# EAGLE design NESv3 (EAGLE 5.11)
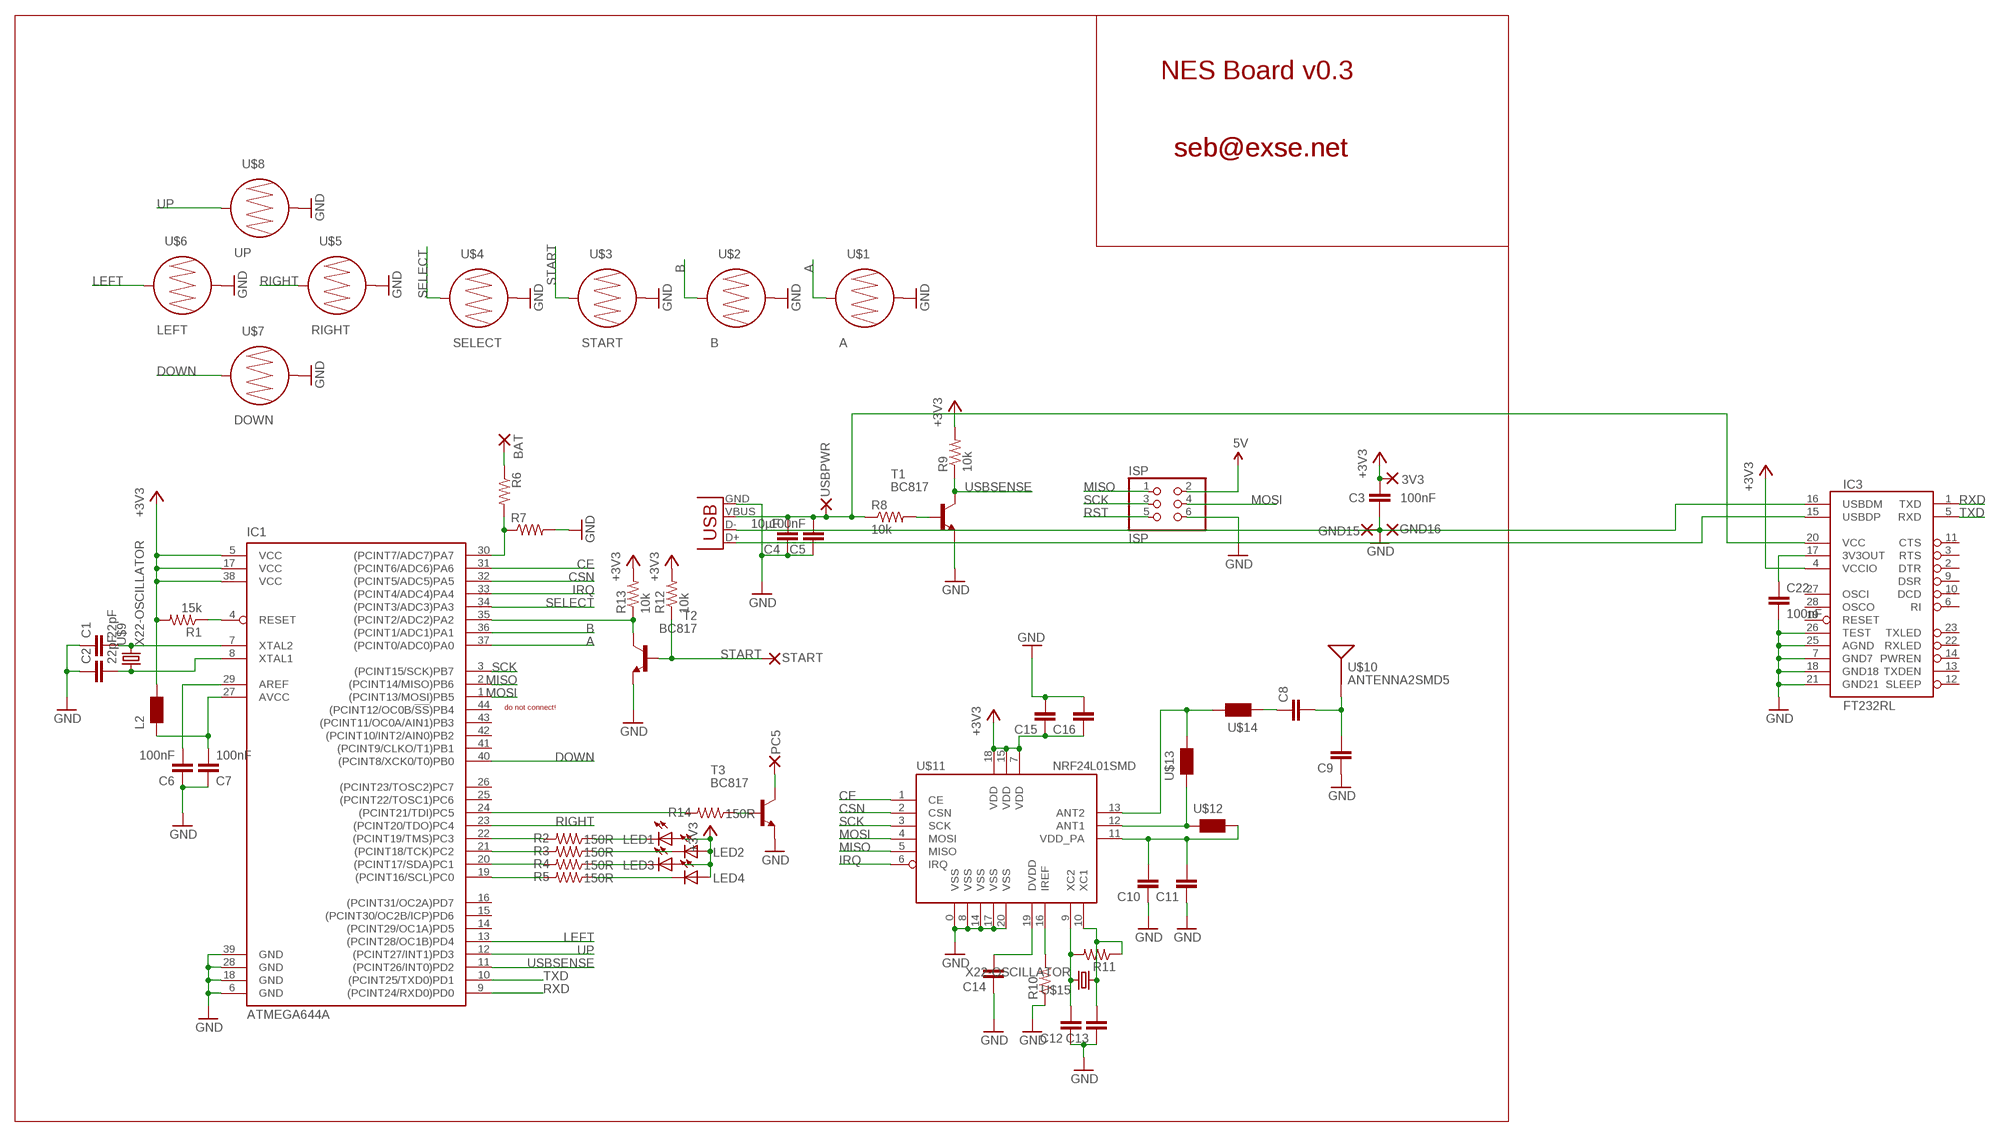
[diagram p0: schematic, sheet 1]

## Parts
3V3  SMD2  [SMD1,27-2,54]
BAT  SMD2  [SMD1,27-2,54]
C1  22pF  CAP0805  [0805]
C2  22pF  CAP0805  [0805]
C3  100nF  CAP0805  [0805]
C4  10µF  CAP0805  [0805]
C5  100nF  CAP0805  [0805]
C6  100nF  CAP0805  [0805]
C7  100nF  CAP0805  [0805]
C8  CAP0805  [0805]
C9  CAP0805  [0805]
C10  CAP0805  [0805]
C11  CAP0805  [0805]
C12  CAP0805  [0805]
C13  CAP0805  [0805]
C14  CAP0805  [0805]
C15  CAP0805  [0805]
C16  CAP0805  [0805]
C22  100nF  CAP0805  [0805]
GND15  SMD2  [SMD1,27-2,54]
GND16  SMD2  [SMD1,27-2,54]
IC1  ATMEGA644A  [TQFP44]
IC3  FT232RL  FT232RLSSOP  [SSOP28DB]
ISP  ISP  PINHD-2X03_2.54  [2X03]
L2  WE-KIHQ_0805  [WE-KI_0805_B]
LED1  LED3MM  [LED3MM]
LED2  LED3MM  [LED3MM]
LED3  LED3MM  [LED3MM]
LED4  LED3MM  [LED3MM]
PC5  SMD2  [SMD1,27-2,54]
R1  15k  RESISTOR  [0805]
R2  150R  RESISTOR  [0805]
R3  150R  RESISTOR  [0805]
R4  150R  RESISTOR  [0805]
R5  150R  RESISTOR  [0805]
R6  RESISTOR  [0805]
R7  RESISTOR  [0805]
R8  10k  RESISTOR  [0805]
R9  10k  RESISTOR  [0805]
R10  RESISTOR  [0805]
R11  RESISTOR  [0805]
R12  10k  RESISTOR  [0805]
R13  10k  RESISTOR  [0805]
R14  150R  RESISTOR  [0805]
START  SMD2  [SMD1,27-2,54]
T1  BC817  BC847  [SOT23]
T2  BC817  BC847  [SOT23]
T3  BC817  BC847  [SOT23]
U$1  A  BUTTON-CONDUCTIVESMD  [BUTTON-CONDUCTIVE]
U$2  B  BUTTON-CONDUCTIVESMD  [BUTTON-CONDUCTIVE]
U$3  START  BUTTON-CONDUCTIVESMD  [BUTTON-CONDUCTIVE]
U$4  SELECT  BUTTON-CONDUCTIVESMD  [BUTTON-CONDUCTIVE]
U$5  RIGHT  BUTTON-CONDUCTIVESMD  [BUTTON-CONDUCTIVE]
U$6  LEFT  BUTTON-CONDUCTIVESMD  [BUTTON-CONDUCTIVE]
U$7  DOWN  BUTTON-CONDUCTIVESMD  [BUTTON-CONDUCTIVE]
U$8  UP  BUTTON-CONDUCTIVESMD  [BUTTON-CONDUCTIVE]
U$9  X22-OSCILLATOR  [X22]
U$10  ANTENNA2SMD5  [ANTENNA-CHIP5]
U$11  NRF24L01SMD  [QFN20]
U$12  WE-KIHQ_0805  [WE-KI_0805_B]
U$13  WE-KIHQ_0805  [WE-KI_0805_B]
U$14  WE-KIHQ_0805  [WE-KI_0805_B]
U$15  X22-OSCILLATOR  [X22]
USBPWR  SMD2  [SMD1,27-2,54]
X1  USB-SMD-NS  [USB-MINIB-NOSTOP]

## Nets
5V: ISP.2
+3V3: 3V3.1(P) C3.1 C15.1 C16.1 IC1.5(VCC) IC1.17(VCC) IC1.38(VCC) IC3.4(VCCIO) L2.1 LED1.A LED2.A LED3.A LED4.A R1.2 R9.2 R12.2 R13.2 U$11.7(VDD) U$11.15(VDD) U$11.18(VDD)
+5V: C4.2 C5.2 IC3.20(VCC) R8.1 USBPWR.1(P) X1.VBUS
A: IC1.37((PCINT0/ADC0)PA0) U$1.1
B: IC1.36((PCINT1/ADC1)PA1) U$2.1
CE: IC1.31((PCINT6/ADC6)PA6) U$11.1(CE)
CSN: IC1.32((PCINT5/ADC5)PA5) U$11.2(CSN)
DOWN: IC1.40((PCINT8/XCK0/T0)PB0) U$7.1
GND: C1.1 C2.1 C3.2 C4.1 C5.1 C6.2 C7.2 C9.1 C10.1 C11.1 C12.1 C13.1 C14.1 C15.2 C16.2 C22.2 GND15.1(P) GND16.1(P) IC1.6(GND) IC1.18(GND) IC1.28(GND) IC1.39(GND) IC3.7(GND7) IC3.18(GND18) IC3.21(GND21) IC3.25(AGND) IC3.26(TEST) ISP.6 R7.2 R10.1 T1.2(E) T2.2(E) T3.2(E) U$1.2 U$2.2 U$3.2 U$4.2 U$5.2 U$6.2 U$7.2 U$8.2 U$11.0(VSS) U$11.8(VSS) U$11.14(VSS) U$11.17(VSS) U$11.20(VSS) X1.GND
IRQ: IC1.33((PCINT4/ADC4)PA4) U$11.6(IRQ)
LEFT: IC1.13((PCINT28/OC1B)PD4) U$6.1
MISO: IC1.2((PCINT14/MISO)PB6) ISP.1 U$11.5(MISO)
MOSI: IC1.1((PCINT13/MOSI)PB5) ISP.4 U$11.4(MOSI)
N$1: R14.1 T3.1(B)
N$2: C2.2 IC1.8(XTAL1) U$9.1
N$3: C1.2 IC1.7(XTAL2) U$9.3
N$4: IC1.19((PCINT16/SCL)PC0) R5.2
N$5: IC1.20((PCINT17/SDA)PC1) R4.2
N$6: IC1.21((PCINT18/TCK)PC2) R3.2
N$7: IC1.22((PCINT19/TMS)PC3) R2.2
N$8: LED1.K(C) R2.1
N$9: LED2.K(C) R3.1
N$10: LED3.K(C) R4.1
N$11: LED4.K(C) R5.1
N$12: R10.2 U$11.16(IREF)
N$13: C7.1 IC1.27(AVCC) L2.2
N$14: IC1.30((PCINT7/ADC7)PA7) R6.2 R7.1
N$16: BAT.1(P) R6.1
N$18: R8.2 T1.1(B)
N$20: C6.1 IC1.29(AREF)
N$21: IC1.35((PCINT2/ADC2)PA2) R13.1 T2.3(C)
N$22: IC1.24((PCINT21/TDI)PC5) R14.2
N$23: C13.2 R11.1 U$11.10(XC1) U$15.1
N$24: C12.2 R11.2 U$11.9(XC2) U$15.3
N$25: C10.2 C11.2 U$11.11(VDD_PA) U$12.1
N$26: U$11.12(ANT1) U$12.2 U$13.2
N$27: U$11.13(ANT2) U$13.1 U$14.1
N$28: C8.1 U$14.2
N$29: C8.2 C9.2 U$10.FEED(SIGNAL)
N$30: C14.2 U$11.19(DVDD)
N$31: IC3.16(USBDM) X1.D-
N$32: IC3.15(USBDP) X1.D+
N$35: C22.1 IC3.17(3V3OUT)
PC5: PC5.1(P) T3.3(C)
RIGHT: IC1.23((PCINT20/TDO)PC4) U$5.1
RST: IC1.4(RESET) ISP.5 R1.1
RXD: IC1.9((PCINT24/RXD0)PD0) IC3.1(TXD)
SCK: IC1.3((PCINT15/SCK)PB7) ISP.3 U$11.3(SCK)
SELECT: IC1.34((PCINT3/ADC3)PA3) U$4.1
START: R12.1 START.1(P) T2.1(B) U$3.1
TXD: IC1.10((PCINT25/TXD0)PD1) IC3.5(RXD)
UP: IC1.12((PCINT27/INT1)PD3) U$8.1
USBSENSE: IC1.11((PCINT26/INT0)PD2) R9.1 T1.3(C)
Unconnected: IC1.14((PCINT29/OC1A)PD5) IC1.15((PCINT30/OC2B/ICP)PD6) IC1.16((PCINT31/OC2A)PD7) IC1.25((PCINT22/TOSC1)PC6) IC1.26((PCINT23/TOSC2)PC7) IC1.41((PCINT9/CLKO/T1)PB1) IC1.42((PCINT10/INT2/AIN0)PB2) IC1.43((PCINT11/OC0A/AIN1)PB3) IC1.44((PCINT12/OC0B/!SS!)PB4) IC3.2(DTR) IC3.3(RTS) IC3.6(RI) IC3.9(DSR) IC3.10(DCD) IC3.11(CTS) IC3.12(SLEEP) IC3.13(TXDEN) IC3.14(PWREN) IC3.19(RESET) IC3.22(RXLED) IC3.23(TXLED) IC3.27(OSCI) IC3.28(OSCO)

## Notes on the sheet
- NES Board v0.3
- seb@exse.net | seb@exse.net
- do not connect!

## Library data of the parts
3V3 BAT GND15 GND16 PC5 START USBPWR = wirepad:SMD2: SMD PAD
C1-C16 C22 = SparkFun:CAP: Capacitor Standard 0603 ceramic capacitor, and 0.1" leaded capacitor.
IC1 = atmel:ATMEGA644: 8-bit Microcontroller with 64K Bytes In-System Programmable Flash Source: http://www.atmel.com/dyn/resources/prod_documents/doc2593.pdf; MPN: ATMEGA644PV-10AU; OC_FARNELL: 1455123; OC_NEWARK: 58M3748
IC3 = SparkFun:FT232RL: USB UART FT232RL 4th Generation USB UART (USB <-> Serial) Controller. Spark Fun Electronics SKU : COM-00650
ISP = pinhead-2:PINHD-2X03: PIN HEADER
L2 U$12-U$14 = wuerth-elektronik:WE-KIHQ: SMD Wire Wound Ceramic Inductor WE-KIHQ - High current - Highest Quality factor in size 0805 - up to 98 - High thermal stability - High SRF -- Bluetooth -- Wireless LAN -- RF oscillation circuit -- IF impedance matching -- IG choke
LED1-LED4 = SparkFun:LED: LEDs Standard schematic elements and footprints for 5mm, 3mm, 1206, and 0603 sized LEDs. 5mm - Spark Fun Electronics SKU : COM-00529 (and others)
R1-R14 = SparkFun:RESISTOR: Resistor Basic schematic elements and footprints for 0603, 1206, and PTH 1/10th watt (small) resistors.
T1-T3 = transistor:BC847: NPN TRANSISTOR
U$1-U$8 = SparkFun:BUTTON-CONDUCTIVE: Conductive Button Used with rubber key pads. This one was designed and proven to work with the PolyCase Key FOB enclosures.
U$9 U$15 = seb:X22-OSCILLATOR
U$10 = SparkFun:ANTENNA2: Antenna Single endded antenna. Common with smaller chip antennas. CHIP4 package is the GPS Chip Antenna SKU: GPS-08418. CHIP5 package is 2.4GHz chip antenna SKU: WRL-00144.
U$11 = SparkFun:NRF24L01: 2.4GHz Low Power Transceiver This is the very popular, low cost, very low power RF transceiver from Nordic Semiconductor. Simple SPI interface. SKU: COM-00690
X1 = SparkFun:USB: USB Connectors USB-B-PTH is fully proven SKU : PRT-00139 USB-miniB is fully proven SKU : PRT-00587 USB-A-PCB is untested. USB-A-H is throughly reviewed, but untested. Spark Fun Electronics SKU : PRT-00437 USB-B-SMT is throughly reviewed, but untested. Needs silkscreen touching up. USB-A-S has not been used/tested USB-MB-H has not been used/tested

## Board
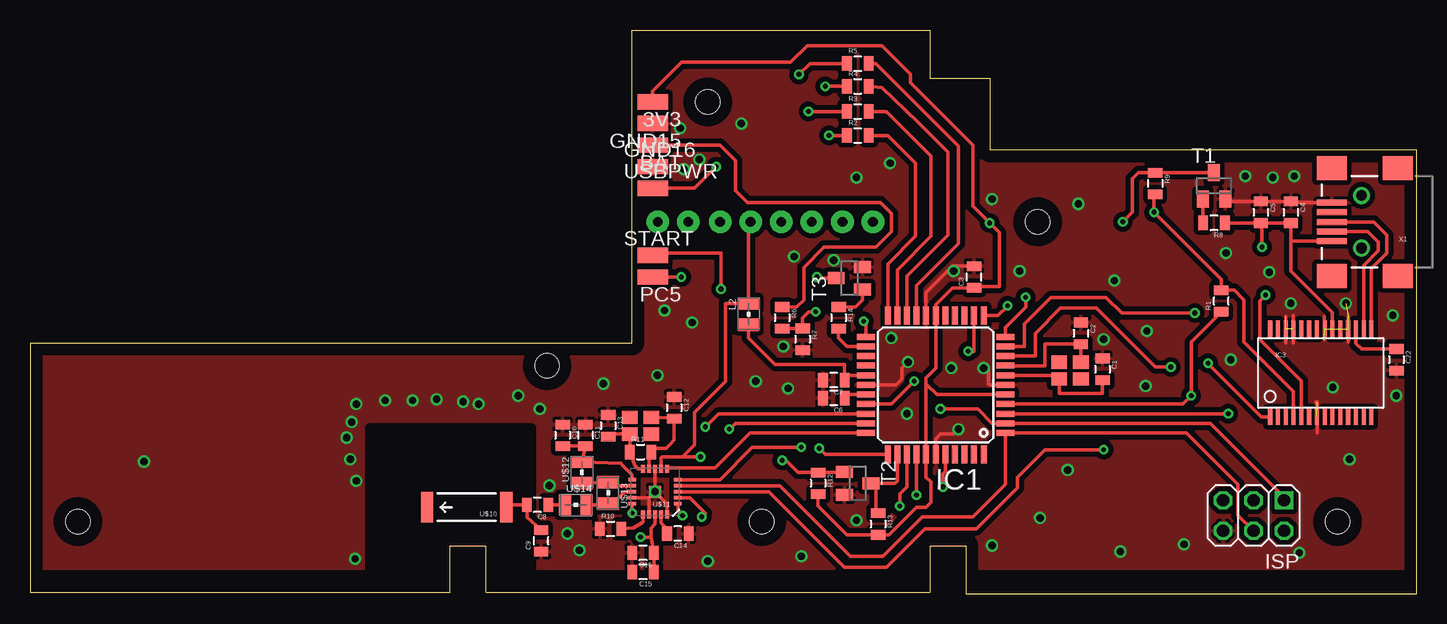
[diagram p1: board, top side]
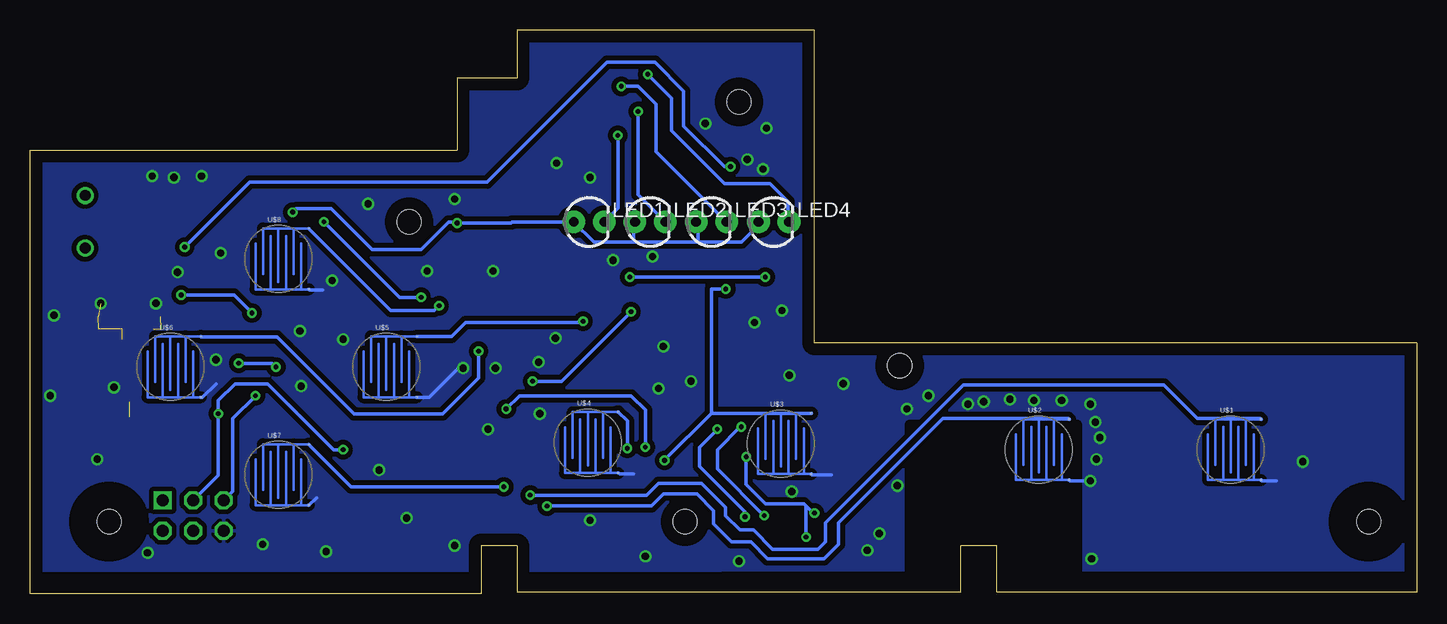
[diagram p2: board, bottom side, seen from below]

Size 115.6 x 47 mm. Coordinates in mm from the lower left corner, seen from the top.
Outline: 0,0.1 35,0.1 35,4 38,4 38,0.1 75,0.1 75,4 78,4 78,0 115.6,0 115.6,37 80,37 80,43 75,43 75,47 50.2,47 50.2,20.9 0,20.9 0,0.1
Copper layers (1*16): Top 0.035mm / dielectric 1.5mm / Bottom 0.035mm
Design rules "default *": minimum track width 10mil, minimum drill 0.3mm, track to track 8mil, track to pad 8mil, pad to pad 8mil, via to via 8mil, smd to smd 8mil, copper to edge 40mil, drill to drill 8mil, minimum pad ring 10mil, minimum via ring 8mil, stop-mask expansion 4mil, vias tented up to drill 0.6mm, thermal gap 10mil
Holes 2 mm at 4,6 61,6 109,6 56.5,41 84,31 43.1,19
tKeepout: area 91.3,15.9 to 97.3,21.9; area 19.6,11 to 25.6,17
bKeepout: area 59.6,4.6 to 62.4,7.4; area 55.1,39.6 to 57.9,42.4; area 41.7,17.7 to 44.5,20.5; area 82.4,29.5 to 85.2,32.3
tRestrict: area 28.3,0.4 to 41.8,13.8; 4 lines
bRestrict: area 28.3,0.2 to 42.3,14.1; area 107.6,4.6 to 110.4,7.4; area 2.6,4.6 to 5.4,7.4

### Footprints (pad centres in the part's own frame; a part is rotated, then mirrored left to right if it is on the bottom)
SMD1,27-2,54 = smd 1.27 x 2.54: 1 0,0
0805 = smd 0.8 x 1.2: 1 -0.9,0; 2 0.9,0
TQFP44 = smd 1.5 x 0.5: 1 -5.8,4; 2 -5.8,3.2; 3 -5.8,2.4; 4 -5.8,1.6; 5 -5.8,0.8; 6 -5.8,0; 7 -5.8,-0.8; 8 -5.8,-1.6; 9 -5.8,-2.4; 10 -5.8,-3.2; 11 -5.8,-4; 23 5.8,-4; 24 5.8,-3.2; 25 5.8,-2.4; 26 5.8,-1.6; 27 5.8,-0.8; 28 5.8,0; 29 5.8,0.8; 30 5.8,1.6; 31 5.8,2.4; 32 5.8,3.2; 33 5.8,4 | smd 0.5 x 1.5: 12 -4,-5.8; 13 -3.2,-5.8; 14 -2.4,-5.8; 15 -1.6,-5.8; 16 -0.8,-5.8; 17 0,-5.8; 18 0.8,-5.8; 19 1.6,-5.8; 20 2.4,-5.8; 21 3.2,-5.8; 22 4,-5.8; 34 4,5.8; 35 3.2,5.8; 36 2.4,5.8; 37 1.6,5.8; 38 0.8,5.8; 39 0,5.8; 40 -0.8,5.8; 41 -1.6,5.8; 42 -2.4,5.8; 43 -3.2,5.8; 44 -4,5.8
SSOP28DB = smd 0.348 x 1.397: 1 -4.225,-3.656; 2 -3.575,-3.656; 3 -2.925,-3.656; 4 -2.275,-3.656; 5 -1.625,-3.656; 6 -0.975,-3.656; 7 -0.325,-3.656; 8 0.325,-3.656; 9 0.975,-3.656; 10 1.625,-3.656; 11 2.275,-3.656; 12 2.925,-3.656; 13 3.575,-3.656; 14 4.225,-3.656; 15 4.225,3.656; 16 3.575,3.656; 17 2.925,3.656; 18 2.275,3.656; 19 1.625,3.656; 20 0.975,3.656; 21 0.325,3.656; 22 -0.325,3.656; 23 -0.975,3.656; 24 -1.625,3.656; 25 -2.275,3.656; 26 -2.925,3.656; 27 -3.575,3.656; 28 -4.225,3.656
2X03 = drill 1.016 square: 1 -2.54,-1.27 | drill 1.016 octagon: 2 -2.54,1.27; 3 0,-1.27; 4 0,1.27; 5 2.54,-1.27; 6 2.54,1.27
WE-KI_0805_B = smd 1.02 x 1.78: 1 -0.89,0; 2 0.89,0
LED3MM = drill 0.813 pad 1.88 round: A -1.27,0; K 1.27,0
SOT23 = smd 1 x 1.4: 1 -0.95,-1.1; 2 0.95,-1.1; 3 0,1.1
BUTTON-CONDUCTIVE = smd 0.203 x 0.203: 1 2.54,2.54; 2 2.54,-2.54
X22 = smd 1.3 x 1.1: 1 0.9,0.7; 2 -0.9,0.7; 3 -0.9,-0.7; 4 0.9,-0.7
ANTENNA-CHIP5 = smd 1.016 x 2.54: FEED -3.302,0; NC 3.302,0
QFN20 = smd 1 x 1: 0 0,0 | smd 0.65 x 0.3: 1 -1.9,1; 2 -1.9,0.5; 3 -1.9,0; 4 -1.9,-0.5; 5 -1.9,-1; 11 1.9,-1; 12 1.9,-0.5; 13 1.9,0; 14 1.9,0.5; 15 1.9,1 | smd 0.3 x 0.65: 6 -1,-1.9; 7 -0.5,-1.9; 8 0,-1.9; 9 0.5,-1.9; 10 1,-1.9; 16 1,1.9; 17 0.5,1.9; 18 0,1.9; 19 -0.5,1.9; 20 -1,1.9
USB-MINIB-NOSTOP = smd 2.5 x 0.5: D+ 2.5,0; D- 2.5,0.8; GND 2.5,-1.6; ID 2.5,-0.8; VBUS 2.5,1.6 | smd 2.5 x 2: G1 -3,-4.5; G2 -3,4.5; G3 2.5,4.5; G4 2.5,-4.5 | drill 0.9 pad 0.8 round: H1 0,2.2 | drill 0.9 pad 0.787 round: H2 0,-2.2

### Placement (x,y rotation side)
3V3  51.9,41 90 top
BAT  51.9,37.4 90 top
C1  89.4,18.7 270 top
C2  87.6,21.7 270 top
C3  78.7,26.4 90 top
C4  105.1,31.8 270 top
C5  102.6,31.8 270 top
C6  67,16.3 180 top
C7  67,17.8 180 top
C8  42.3,7.4 180 top
C9  42.6,4.4 90 top
C10  44.4,13.2 270 top
C11  46.3,13.2 270 top
C12  53.7,15.5 270 top
C13  48.2,14 270 top
C14  54,5 180 top
C15  51.1,1.8 180 top
C16  51.1,3.4 180 top
C22  113.9,19.5 270 top
GND15  51.9,39.2 90 top
GND16  51.9,35.6 270 top
IC1  75.5,17.4 180 top
IC3  107.6,18.4 0 top
ISP  102,6.5 180 top
L2  59.9,23.3 270 top
LED1  69,31 0 bottom
LED2  63.9,31 0 bottom
LED3  58.8,31 0 bottom
LED4  53.6,31 0 bottom
PC5  51.9,26.4 90 top
R1  99.3,24.4 90 top
R2  69,38.2 0 top
R3  69,40.2 0 top
R4  69,42.3 0 top
R5  69,44.2 0 top
R6  62.7,23 270 top
R7  64.4,21.2 270 top
R8  98.7,30.9 180 top
R9  93.8,34.2 270 top
R10  48.4,5.4 0 top
R11  50.9,11.8 0 top
R12  65.7,9.2 270 top
R13  70.7,5.8 270 top
R14  67.4,23 270 top
START  51.9,28.2 270 top
T1  98.7,34 0 top
T2  69,9.2 270 top
T3  68.3,26.3 90 top
U$1  15.5,12 0 bottom
U$2  31.5,12 0 bottom
U$3  53,12.5 0 bottom
U$4  69.1,12.6 0 bottom
U$5  85.9,18.9 0 bottom
U$6  103.9,18.9 0 bottom
U$7  94.9,9.9 0 bottom
U$8  94.9,27.9 0 bottom
U$9  86.7,18.6 0 top
U$10  36.4,7.2 180 top
U$11  52.1,8.5 180 top
U$12  46,10.1 270 top
U$13  48.2,8.4 90 top
U$14  45.5,7.4 180 top
U$15  50.9,14 180 top
USBPWR  51.9,33.8 270 top
X1  111,31 180 top

### Tracks (layer width: path | path; a pad name or v marks a point on that pad's centre or on a via)
+3V3  (via drill 0.4)
  Top 0.305: U$11.18 52.1,5.8 51.75,5.45 51.75,4.7 | 51.75,4.7 C16.1 C15.1 | v50.2,6.7 U$11.15 | U$11.7 52.6,11.3 52.7,11.4 54.4,11.4 | 51.75,4.7 v50.9,4.7 | v55.9,11.4 54.4,11.4 | 54.4,11.4 55.4,12.4 55.4,15.1 57.99,17.69 57.99,24.19 L2.1 59.9,30.83 LED3.A | 74.7,17.5 IC1.38 74.7,9.7 75.1,9.3 75.1,7.6 74.7,7.2 73.9,7.2 71.6,4.9 R13.2 | 74.7,17.5 74.7,18 75.5,18.8 IC1.17 75.5,24.1 76.9,25.5 C3.1 78.8,25.6 80.8,25.6 80.8,30.1 v80,30.9 78.6,32.3 78.6,37.4 73.4,42.6 73.4,43.3 71,45.7 64.8,45.7 63.4,44.3 54.3,44.3 51.9,41.9 3V3.1 | IC1.5 75.6,16.6 74.7,17.5 | R9.2 93.7,33.2 v93.7,31.8 99.3,26.2 R1.2 100.4,25.3 101.2,24.5 101.2,21 105.33,16.88 IC3.4 | R12.2 65.7,7.3 68.1,4.9 R13.2 | R13.2 70.5,4.9
  Bottom 0.305: 65.3,29.3 68.57,29.3 LED1.A 75.4,31 75.5,30.9 v80,30.9 80,31 80.7,31 83,28.7 87.1,28.7 90.5,32.1 93.4,32.1 v93.7,31.8 | 59.9,29.3 65.3,29.3 | 59.9,29.3 56.3,29.3 54.87,30.73 LED4.A | LED3.A 59.9,30.83 59.9,29.3 | LED2.A 65.3,30.87 65.3,29.3 | v55.9,11.4 55.9,9.1 54.3,7.5 51.1,7.5 50.9,7.3 | 50.9,7.3 50.3,6.7 v50.2,6.7 | v50.9,4.7 50.9,7.3
+5V  (via drill 0.4)
  Top 0.305: C5.2 C4.2 105.1,29.4 | C5.2 R8.1 | 105.1,29.4 X1.VBUS | v102.7,28.9 102.7,30.8 C5.2 | USBPWR.1 55.4,33.8 v57.2,35.6 | IC3.20 108.58,23.43 105.1,26.9 105.1,29.4
  Bottom 0.305: v102.7,28.9 97.3,34.3 77.5,34.3 67.5,44.3 63.5,44.3 61.1,41.9 61.1,39 57.7,35.6 v57.2,35.6
A  (via drill 0.4)
  Top 0.305: v73.9,8.2 IC1.37
  Bottom 0.305: U$1.1 13.02,14.6 18.3,14.6 21.1,17.4 37.8,17.4 49.3,5.9 49.3,4.3 49.9,3.7 53.7,3.7 55.3,5.3 56.4,5.3 57.6,6.5 57.6,7.2 59.6,9.2 63.2,9.2 64.2,8.2 v73.9,8.2
B  (via drill 0.4)
  Top 0.305: IC1.36 73.1,8.9 72.5,8.3 v72.5,7.3
  Bottom 0.305: U$2.1 29.02,14.6 34.8,14.6 | 34.8,14.6 35,14.6 | v72.5,7.3 72.2,7.3 63.8,7.3 62.8,8.3 60,8.3 58.6,6.9 58.6,5.8 57.1,4.3 56.5,4.3 55.5,4.3 54.1,2.9 49.4,2.9 48.2,4.1 48.2,5.9 39.7,14.4 39.5,14.6 34.8,14.6
CE  (via drill 0.4)
  Top 0.305: v54.4,6.5 54,6.9 U$11.1 | IC1.31 57.4,15 v56.3,13.9
  Bottom 0.305: v56.3,13.9 56.4,13.9 58.3,12 58.3,10.4 v54.4,6.5
CSN  (via drill 0.4)
  Top 0.305: IC1.32 64,14.2 59.6,14.2 58.8,14.2 v58.3,13.7 | 55,8 55.2,7.8 | U$11.2 55,8 | 55,8 56.3,6.7 v56,6.4
  Bottom 0.305: v56,6.4 56,6.8 59.8,10.6 59.8,12.2 v58.3,13.7
DOWN  (via drill 0.4)
  Top 0.305: v76.1,8.9 76.1,10 76.3,10.2 IC1.40
  Bottom 0.305: U$7.1 92.32,12.4 88.82,8.9 v76.1,8.9
GND  (via drill 0.6)  (7 unrouted)
  Top 0.305: X1.GND 105.1,32.6 C4.1 C5.1 99.65,32.7 T1.2 | 69.6,17.4 IC1.28 72.2,17.4 72.7,17.9 72.7,18.8 v73.2,19.3 | 51.6,8 U$11.17 | U$11.14 51.6,8 | 51.6,8 U$11.0 | U$11.0 U$11.8 | U$11.20 53.1,7.5 U$11.0 | IC1.18 74.7,25.1 76.9,27.3 C3.2 | IC1.6 80,17.4 79.9,17.5 79.9,18.8 | IC1.39 75.5,12.9 75.9,13.3 77,13.3 v77.4,13.7 | 104.7,20.9 104.7,23.1 | 105.3,20.9 105.3,23.2 | 107.9,21.2 107.9,23.1 | 109.9,21 109.9,23.1 | 107.2,16 107.3,16 107.3,13.4
  Bottom 0.305: U$7.2 91.72,8 91.7,8 | U$8.2 92.3,25.3 91.2,25.3 | U$4.2 66.42,10 65.3,10 | U$3.2 50.4,9.9 48.8,9.9 | U$2.2 28.9,9.4 27.7,9.4 | U$1.2 12.9,9.4 11.7,9.4 | U$5.2 82.34,16.36 79.5,19.2 | U$6.2 101.24,16.36 100.1,17.5
  other vias: 26.7,11.2 36.1,16 26.8,14.3 43.3,9 96.2,4.1 103.6,34.7 76.8,18.8 86.5,10.3 71.8,21.3 89.5,21.2 54.5,35.4 101.3,34.8 105.4,34.8 113.9,16.5 113.6,23.2 108.6,17.2 77,26.9 90.9,3.5 68.9,6.1 73.1,15 82.5,26.9 31.9,16.1 37.4,15.8 26.4,13 63.7,28.1 47.8,17.5 27.2,9.4 9.5,11 80.2,4 105.8,3.4 99.7,28.4 103.3,26.8 93.1,21.9 59.3,39.2 52.1,8.5 56.5,2.7 55.2,22.6 84.2,6.3 93,17.3 45.8,3.6 87.4,32.5 110,11.2 52.9,23.6 90.4,26.1 27.2,15.8 27.1,2.9 33.9,16.2 67,27.8 29.6,16.1 52.3,18.2 60.5,17.7 63.2,17.1 40.7,16.5 44.8,5 42.5,15.4 105.1,24.2 54.2,38.8 55.8,36.2 71.7,35.9 62.8,20.6 80.2,32.9 68.9,34.7 79.5,18.8 100.1,19.5 64.3,3.1 109.7,24.2
  pour Top (isolate 0.4): 115.9,2.1 115.8,47.1 -0.1,47.1 0,2.1
  pour Bottom (isolate 0.4): 115.9,1.9 115.6,47.2 -0.3,47.3 0,2
IRQ
  Top 0.305: U$11.6 53.2,10.5 57.1,10.5 60,13.4 IC1.33
LEFT  (via drill 0.4)
  Top 0.305: IC1.13 78.7,20.2 v78.2,20.2
  Bottom 0.305: v78.2,20.2 78.2,18 81.2,15 88.6,15 95,21.4 101.32,21.4 U$6.1
MISO  (via drill 0.4)
  Top 0.305: v75.9,15.4 79,15.4 80.2,14.2 IC1.2 98.4,14.2 104.54,8.06 ISP.1 | U$11.5 57.5,9.5 60.2,12.2 v64.3,12.2
  Bottom 0.305: v64.3,12.2 64.3,15.3 65.5,16.5 74.8,16.5 v75.9,15.4
MOSI
  Top 0.305: U$11.4 62.5,9 68.4,3.1 71.1,3.1 74.4,6.4 78.6,6.4 81.3,9.1 IC1.1 96.4,13.4 100.7,9.1 100.7,6.53 ISP.4
N$1
  Top 0.305: R14.1 68.8,23.9 69.4,24.5 T3.1
N$2
  Top 0.305: IC1.8 84.6,19 84.6,20.8 C2.2 U$9.1
N$3
  Top 0.305: IC1.7 85.6,18.2 U$9.3 85.8,16.7 89.4,16.7 C1.2
N$4
  Top 0.305: R5.2 70.5,44.2 74,40.7 77.4,37.3 77.4,29.2 73.9,25.7 IC1.19
N$5
  Top 0.305: R4.2 71,42.2 74,39.3 76.5,36.8 76.5,29.9 73.1,26.5 IC1.20
N$6
  Top 0.305: IC1.21 72.3,27 75.1,29.8 75.1,36.5 71.7,39.9 71.4,40.2 R3.2
N$7
  Top 0.305: IC1.22 71.5,27.5 73.8,29.8 73.8,35.9 72.1,37.6 71.5,38.2 R2.2
N$8  (via drill 0.4)
  Top 0.305: v66.6,38.2 R2.1
  Bottom 0.305: LED1.K 66.6,32.13 v66.6,38.2
N$9  (via drill 0.4)
  Top 0.305: v64.9,40.2 R3.1
  Bottom 0.305: LED2.K 64.9,33.27 v64.9,40.2
N$10  (via drill 0.4)
  Top 0.305: v66.3,42.3 R4.1
  Bottom 0.305: LED3.K 63.4,36.87 63.4,40.8 64.9,42.3 v66.3,42.3
N$11  (via drill 0.4)
  Top 0.305: R5.1 65,44.2 v64.1,43.3
  Bottom 0.305: LED4.K 52.4,31.07 52.4,32.7 53.9,34.2 57.7,34.2 62.1,38.6 62.1,41.3 64,43.2 v64.1,43.3
N$12
  Top 0.305: R10.2 50.3,5.5 51,5.9 51.1,6 U$11.16
N$13
  Top 0.305: C7.1 68.2,18.2 IC1.27 67.9,18.2 67.9,17.7 67.9,19.1 64.7,19.1 62.1,19.1 60.3,20.9 59.9,21.3 L2.2
N$14  (via drill 0.4)
  Top 0.305: R6.2 R7.1 64.4,23 64.9,23.5 v65.5,23.5 | IC1.30 71.8,15.8 v73.7,17.7
  Bottom 0.305: v73.7,17.7 71.3,17.7 v65.5,23.5
N$16
  Top 0.305: BAT.1 57.5,37.4 58.8,36.1 58.8,33.6 59.8,32.6 70.9,32.6 71.8,31.7 71.8,30.2 70.5,28.9 66.2,28.9 64.5,27.2 64.5,24.5 63.9,23.9 R6.1
N$18
  Top 0.305: R8.2 97.75,30.5 T1.1
N$20
  Top 0.305: IC1.29 68.2,16.6 C6.1
N$21
  Top 0.305: IC1.35 72.3,9.4 72.1,9.2 T2.3 70.5,9.3 70.5,6.7 R13.1
N$22
  Top 0.305: IC1.24 68.1,20.6 67.4,21.3 R14.2
N$23
  Top 0.305: C13.2 48.25,13.3 U$15.1 50,12.25 R11.1 50.45,10.65 50.5,10.6 50.7,10.4 U$11.10
N$24
  Top 0.305: U$15.3 51.85,14.75 C12.2 53.7,12.8 53.4,12.5 53,12.1 52.05,12.1 R11.2 51.6,11.65 U$11.9
N$25
  Top 0.305: U$11.11 50.2,9.9 49.4,10.7 49.25,10.85 U$12.1 C11.2 C10.2
N$26
  Top 0.305: U$11.12 48.45,9 U$13.2 U$12.2
N$27
  Top 0.305: U$14.1 48.3,7.4 U$13.1 48.55,7.45 49.2,8.1 49.6,8.5 U$11.13
N$28
  Top 0.305: C8.1 U$14.2
N$29
  Top 0.305: U$10.FEED 39.8,7.4 C8.2 41.45,6.35 C9.2
N$30
  Top 0.305: U$11.19 52.6,5.9 52.8,5.7 52.95,5.55 C14.2
N$31
  Top 0.305: X1.D- 111.5,30.2 112.4,29.3 112.4,28.6 111.17,27.38 IC3.16
N$32
  Top 0.305: IC3.15 111.83,27.12 113.1,28.4 113.1,29.9 112,31 X1.D+
N$35
  Top 0.305: IC3.17 110.53,20.88 111,20.4 C22.1
PC5  (via drill 0.4)
  Top 0.305: T3.3 65.7,26.3 v65.6,26.4 | PC5.1 v54.3,26.4
  Bottom 0.305: v54.3,26.4 v65.6,26.4
RIGHT  (via drill 0.4)
  Top 0.305: v69.5,22.7 69.7,22.5 IC1.23
  Bottom 0.305: U$5.1 80.46,21.44 79.3,22.6 69.6,22.6 v69.5,22.7
RST  (via drill 0.4)
  Top 0.305: IC1.4 96.1,15.8 v96.8,16.5 | v96.8,16.5 96.8,17.9 | R1.1 96.8,21 v96.8,16.5
  Bottom 0.305: ISP.5 98.7,8.53 98.7,14.6 v96.8,16.5
RXD  (via drill 0.4)
  Top 0.305: IC1.9 83.8,19.8 83.8,21.7 85.9,23.8 88.9,23.8 93.8,18.9 v95.1,18.9 | v98.2,19.2 102.66,14.74 IC3.1
  Bottom 0.305: v95.1,18.9 95.4,19.2 v98.2,19.2
SCK  (via drill 0.4)
  Top 0.305: v99.9,15 IC1.3 | v89.5,12 84.6,12 82.3,9.7 82.3,8.8 78.9,5.4 74.6,5.4 71.4,2.2 67.9,2.2 61.6,8.5 U$11.3
  Bottom 0.305: v89.5,12 90.3,12 95.8,17.5 98.5,17.5 99.9,16.1 v99.9,15 99.9,9.87 ISP.3
SELECT  (via drill 0.4)
  Top 0.305: IC1.34 66.3,11.6 v65.8,12.1
  Bottom 0.305: v65.8,12.1 65.8,14.38 U$4.1
START  (via drill 0.4)
  Top 0.305: v57.6,25.4 57.6,28.4 52.5,28.4 START.1 | v62.7,11.1 63,11.1 64,10.1 R12.1 67.85,10.1 T2.1
  Bottom 0.305: v62.7,11.1 62.7,11.14 58.8,15.04 | U$3.1 58.8,15.04 | v57.6,25.4 58.8,25.4 58.8,15.04
TXD  (via drill 0.4)
  Top 0.305: IC1.10 82.9,20.6 82.9,22.5 85.1,24.7 89.7,24.7 91,23.4 v97.1,23.4 | IC3.5 105.97,17.73 102.5,21.2 102.5,24.4 v103,24.9
  Bottom 0.305: v97.1,23.4 98.6,24.9 v103,24.9
UP  (via drill 0.4)
  Top 0.305: IC1.12 80.7,23.2 v81.5,24
  Bottom 0.305: U$8.1 85.52,23.6 81.9,23.6 v81.5,24
USBSENSE  (via drill 0.4)
  Top 0.305: v91.1,31 91.9,31.8 91.9,34.6 92.4,35.1 R9.1 T1.3 | IC1.11 81.3,22.2 82.3,23.2 83,23.9 v83,24.7
  Bottom 0.305: v83,24.7 84.8,24.7 v91.1,31

### Text on the board
tStop: 3V3 | GND | BAT | GND | USB5V | ON | OFF | PentaWall GamePad v0.3 | seb@exse.net | <<</>>
bStop: seb@exse.net | <<</>>